# EAGLE design monoastavel-cascateando-astavel (EAGLE 9.5.2)
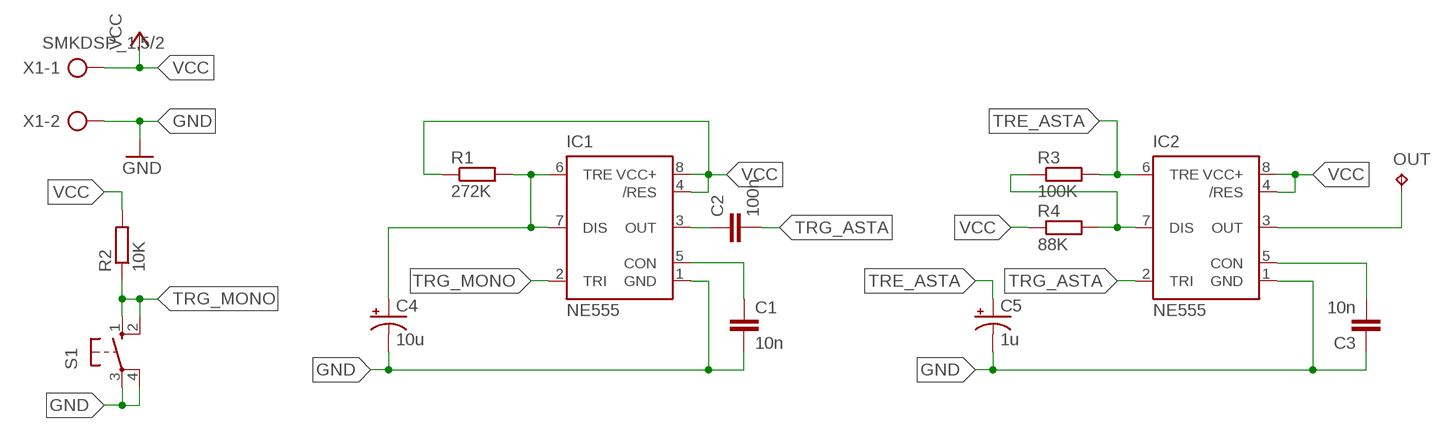
[diagram p0: schematic, sheet 1]

## Parts
C1  10n  C2.5/2  [C2.5-2]
C2  100n  C2.5/2  [C2.5-2]
C3  10n  C2.5/2  [C2.5-2]
C4  10u  CPOL-USTAP5-60  [TAP5-60]
C5  1u  CPOL-USTAP5-60  [TAP5-60]
IC1  NE555  [DIL-08]
IC2  NE555  [DIL-08]
OUT  TPPAD1-13  [P1-13]
R1  272K  R-EU_0207/10  [0207/10]
R2  10K  R-EU_0207/10  [0207/10]
R3  100K  R-EU_0207/10  [0207/10]
R4  88K  R-EU_0207/10  [0207/10]
S1  10-XX  [B3F-10XX]
X1  SMKDSP_1,5/2  [SMKDSP_1,5/2]

## Nets
GND [power]: C1.2 C3.1 C4.- C5.- IC1.1(GND) IC2.1(GND) S1.3(P) S1.4(P1) X1.2
N$1 [signal]: IC2.7(DIS) R3.1 R4.2
N$5 [signal]: C3.2 IC2.5(CON)
N$8 [signal]: IC2.3(OUT) OUT.TP
N$10 [signal]: C1.1 IC1.5(CON)
N$11 [signal]: C2.1 IC1.3(OUT)
N$14 [signal]: C4.+ IC1.6(TRE) IC1.7(DIS) R1.2
TRE_ASTA [signal]: C5.+ IC2.6(TRE) R3.2
TRG_ASTA [signal]: C2.2 IC2.2(TRI)
TRG_MONO [signal]: IC1.2(TRI) R2.1 S1.1(S) S1.2(S1)
VCC [power]: IC1.4(/RES) IC1.8(VCC+) IC2.4(/RES) IC2.8(VCC+) R1.1 R2.2 R4.1 X1.1

## Library data of the parts
C1-C3 = capacitor-wima:C: CAPACITOR naming: grid - package width
C4 C5 = rcl:CPOL-US: POLARIZED CAPACITOR, American symbol; SPICEPREFIX: C
IC1 IC2 = st-microelectronics:NE555: General purpose bipolar Timer; MF: Arrow Electronics; MPN: NE555N; OC_FARNELL: 1467742; OC_NEWARK: 89K1486
OUT = testpad:TP: Test pad
R1-R4 = rcl:R-EU_: RESISTOR, European symbol; SPICEPREFIX: R
S1 = switch-omron:10-XX: OMRON SWITCH; MPN: B3F-1000; OC_FARNELL: 176432; OC_NEWARK: 36M3542
X1 = con-phoenix-smkdsp:SMKDSP_1,5/2: Printklemme, Nennstrom: 17,5 A, Bemessungsspannung: 250 V, Raster: 5,0 mm Source: http://eshop.phoenixcontact.de .. 1733415.pdf; MF: FARNELL; MPN: 1733570; OC_FARNELL: 3041244; OC_NEWARK: 69C8588

## Net classes
0 default: width 1 mm
1 power: width 1 mm
2 signal: width 0.5 mm

## Board
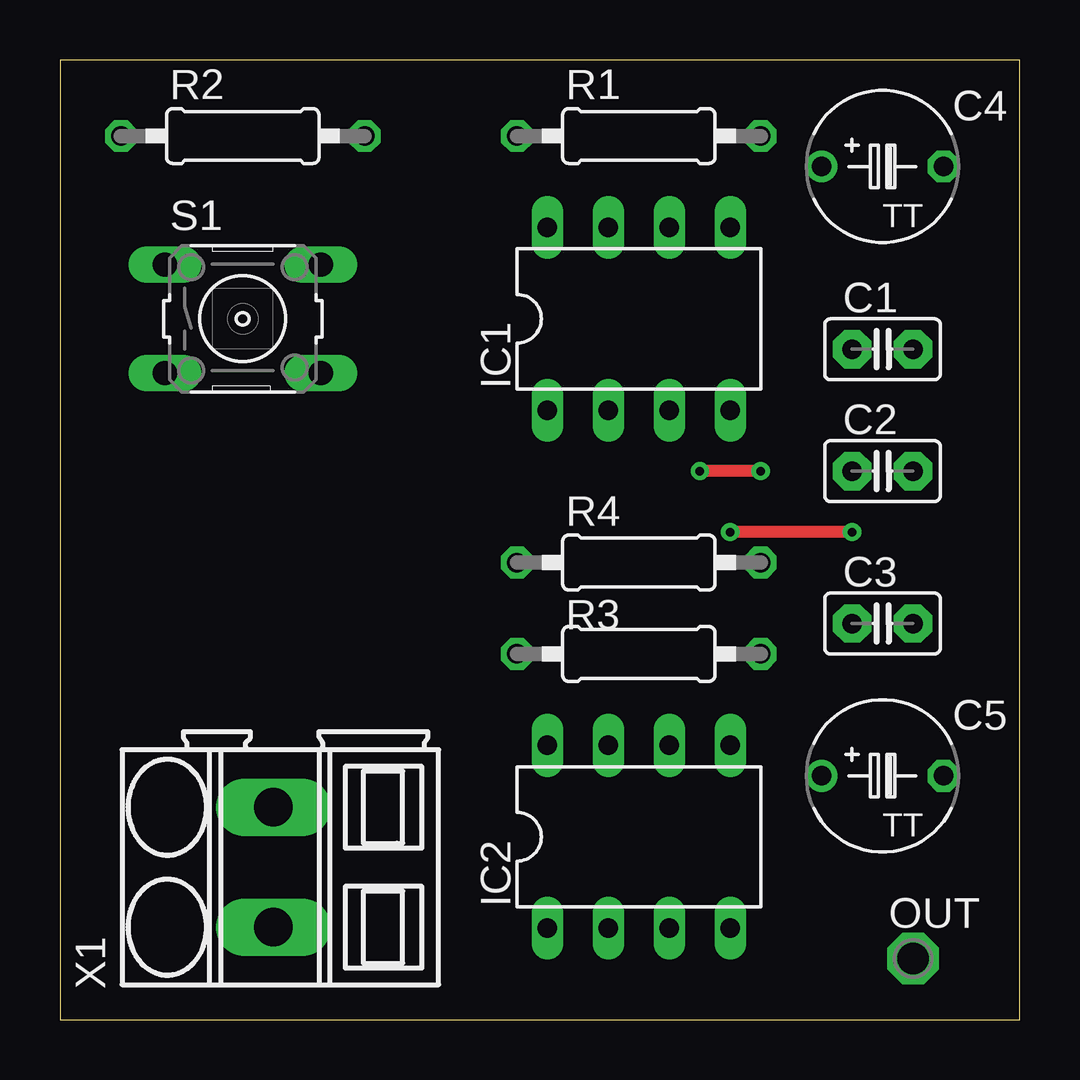
[diagram p1: board, top side]
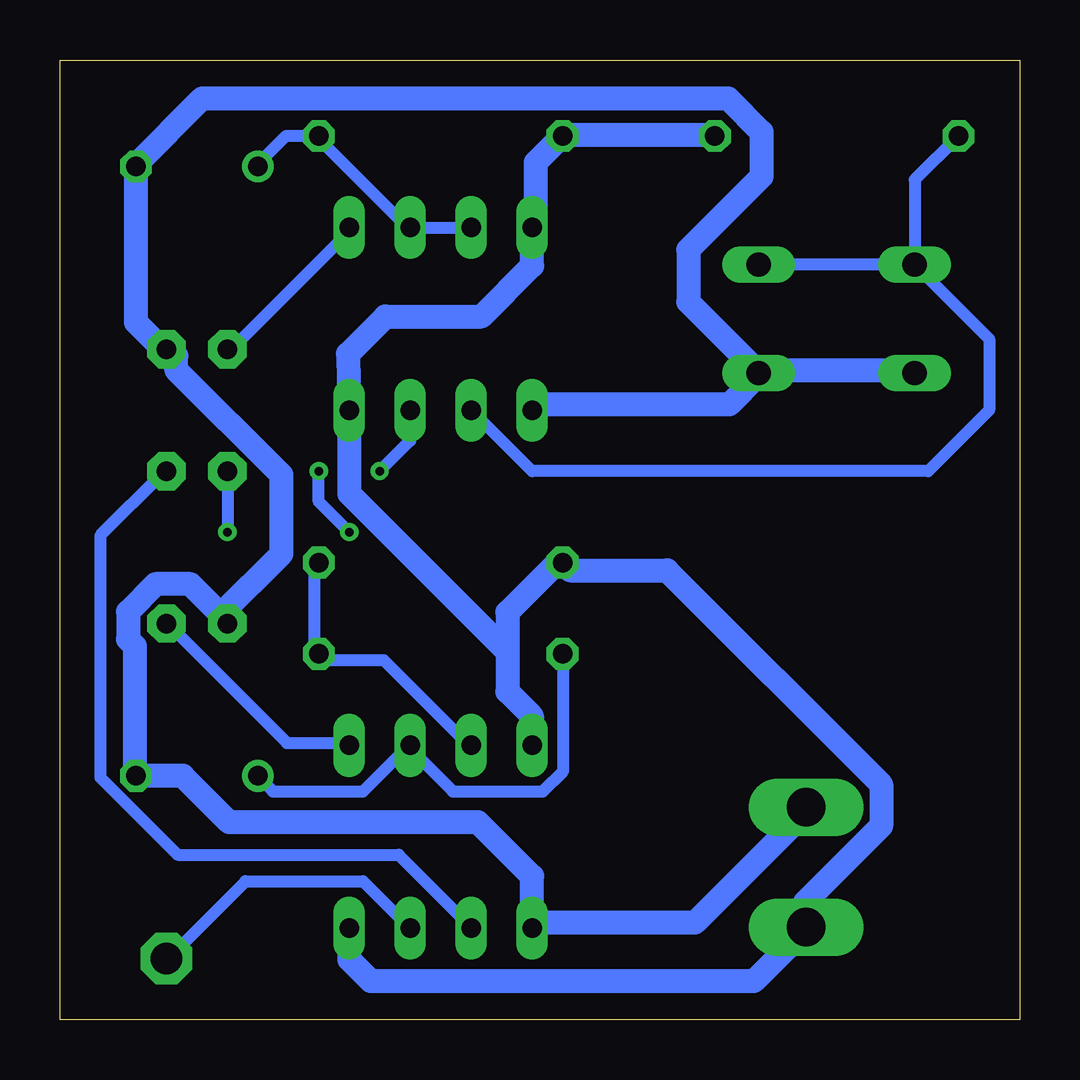
[diagram p2: board, bottom side, seen from below]

Size 40 x 40 mm. Coordinates in mm from the lower left corner, seen from the top.
Outline: 0,0 40,0 40,40 0,40 0,0
Copper layers (1*16): Top 0.035mm / dielectric 1.5mm / Bottom 0.035mm
Design rules "default": minimum track width 6mil, minimum drill 0.35mm, track to track 6mil, track to pad 6mil, pad to pad 6mil, via to via 6mil, smd to smd 6mil, copper to edge 40mil, drill to drill 6mil, minimum pad ring 10mil, minimum via ring 8mil, stop-mask expansion 4mil, vias tented up to drill 0mil, thermal gap 10mil

### Footprints (pad centres in the part's own frame; a part is rotated, then mirrored left to right if it is on the bottom)
C2.5-2 = drill 0.813 pad 1.6 octagon: 1 -1.27,0; 2 1.27,0
TAP5-60 = drill 0.813: + -2.54,0 | drill 0.813 octagon: - 2.54,0
DIL-08 = drill 0.813 long: 1 -3.81,-3.81; 2 -1.27,-3.81; 3 1.27,-3.81; 4 3.81,-3.81; 5 3.81,3.81; 6 1.27,3.81; 7 -1.27,3.81; 8 -3.81,3.81
P1-13 = drill 1.321 pad 2.159 octagon: TP 0,0
0207/10 = drill 0.813 octagon: 1 -5.08,0; 2 5.08,0
B3F-10XX = drill 1.016 long: 1 -3.251,2.261; 2 3.251,2.261; 3 -3.251,-2.261; 4 3.251,-2.261
SMKDSP_1,5/2 = drill 1.6 pad 1.8 long: 1 -2.5,0; 2 2.5,0

### Placement (x,y rotation side)
C1  34.29,27.94 0 top
C2  34.29,22.86 0 top
C3  34.29,16.51 0 top
C4  34.29,35.56 0 top
C5  34.29,10.16 0 top
IC1  24.13,29.21 0 top
IC2  24.13,7.62 0 top
OUT  35.56,2.54 0 top
R1  24.13,36.83 0 top
R2  7.62,36.83 0 top
R3  24.13,15.24 180 top
R4  24.13,19.05 0 top
S1  7.62,29.21 0 top
X1  8.89,6.35 90 top

### Tracks (layer width: path | path; a pad name or v marks a point on that pad's centre or on a via)
GND
  Bottom 1: 33.3,16.88 33.13,16.71 C3.1 | 33.3,16.88 34.57,18.15 36.01,18.15 37.16,17 37.16,15.85 36.88,15.56 36.88,10.37 C5.- 34.88,10.16 32.94,8.22 22.57,8.22 20.32,5.97 IC2.1 20.17,4.03 13.54,4.03 8.93,8.64 X1.2 | 33.3,16.88 30.77,19.41 30.77,22.7 35.15,27.08 35.15,27.66 C1.2 35.72,27.95 36.84,29.06 36.84,35.55 C4.- 36.83,35.64 34.07,38.4 12.16,38.4 10.75,36.99 10.75,35.14 13.81,32.09 13.81,29.91 10.82,26.92 10.95,26.79 | 10.95,26.79 12.1,25.64 20.17,25.64 IC1.1 | 10.95,26.79 S1.4 10.66,27.08 4.61,27.08 S1.3
N$1
  Bottom 0.5: IC2.7 23.05,11.52 26.5,14.98 29.1,14.98 R3.1 29.39,15.27 29.39,19.02 R4.2
N$5
  Bottom 0.5: IC2.5 27.95,11.52 30.54,11.52 35.44,16.42 C3.2
N$8
  Bottom 0.5: IC2.3 25.64,4.03 27.37,5.76 32.27,5.76 35.44,2.59 OUT.TP
N$10
  Bottom 0.5: IC1.5 27.95,32.84 32.84,27.95 C1.1
N$11  (via drill 0.35)
  Top 0.5: v33.02,20.32 v27.94,20.32 | v29.21,22.86 v26.67,22.86
  Bottom 0.5: C2.1 v33.02,20.32 | v27.94,20.32 29.21,21.59 v29.21,22.86 | v26.67,22.86 25.4,24.13 IC1.3
N$14
  Bottom 0.5: IC1.7 22.88,33.01 25.38,33.01 IC1.6 25.64,33.13 29.1,36.59 R1.2 29.22,36.84 30.57,36.84 31.69,35.72 C4.+
TRE_ASTA
  Bottom 0.5: C5.+ 31.69,10.08 31.11,9.51 27.37,9.51 25.64,11.24 IC2.6 25.35,11.24 23.62,9.51 19.88,9.51 19.02,10.37 19.02,14.98 R3.2
TRG_ASTA
  Bottom 0.5: IC2.2 23.05,4.03 25.88,6.87 35.1,6.87 38.32,10.08 38.32,20.17 35.72,22.76 C2.2
TRG_MONO
  Bottom 0.5: R2.1 4.37,35 S1.1 | S1.1 S1.2 | S1.1 1.27,28.37 1.27,25.4 3.81,22.86 20.32,22.86 IC1.2
VCC
  Bottom 1: IC2.4 27.94,2.5 27.04,1.6 11.07,1.6 8.93,3.75 X1.1 8.93,4.32 8.93,4.9 5.76,8.07 5.76,9.79 14.69,18.73 18.73,18.73 R4.1 19.3,19.02 21.34,16.97 21.34,15.32 | R2.2 12.96,36.88 19.02,36.88 R1.1 19.3,36.59 20.17,35.72 20.17,33.13 IC1.8 20.32,31.42 22.43,29.31 26.44,29.31 28,27.75 IC1.4 27.94,21.91 21.34,15.32 | 21.34,15.32 21.34,13.67 20.33,12.65 IC2.8